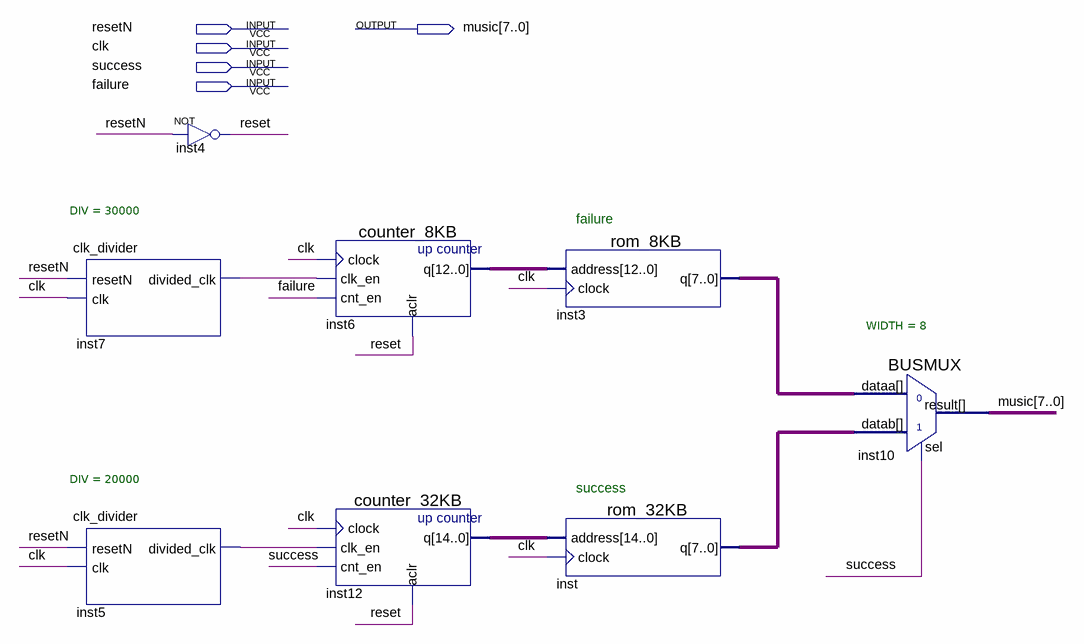
[diagram p0: schematic sheet]
// Quartus schematic music.bdf as structural Verilog: 8 symbols, 5 pins
module music (
  input  resetN,
  input  clk,
  input  success,
  input  failure,
  output [7:0] music
);

  wire inst5_divided_clk, inst7_divided_clk, reset;
  wire [7:0] inst3_q, inst_q;
  wire [12:0] inst6_q;
  wire [14:0] inst12_q;

  clk_divider #(.DIV(30000)) inst7 (.resetN(resetN), .clk(clk), .divided_clk(inst7_divided_clk));
  clk_divider #(.DIV(20000)) inst5 (.resetN(resetN), .clk(clk), .divided_clk(inst5_divided_clk));
  not inst4 (reset, resetN);
  counter_8KB inst6 (.clock(clk), .clk_en(inst7_divided_clk), .cnt_en(failure), .aclr(reset), .q(inst6_q));
  counter_32KB inst12 (.clock(clk), .clk_en(inst5_divided_clk), .cnt_en(success), .aclr(reset), .q(inst12_q));
  rom_8KB inst3 (.address(inst6_q), .clock(clk), .q(inst3_q));
  rom_32KB inst (.address(inst12_q), .clock(clk), .q(inst_q));
  BUSMUX #(.WIDTH(8)) inst10 (.datab(inst_q), .sel(success), .dataa(inst3_q), .result(music));

  // Notes on the sheet:
  //   failure
  //   success
endmodule
